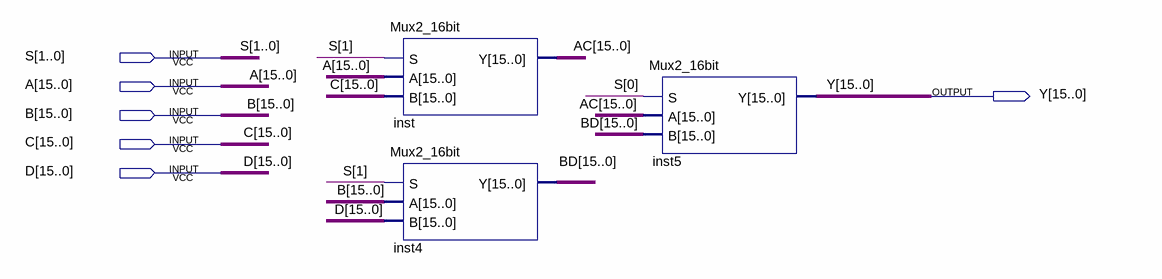
[diagram p0: schematic sheet]
// Quartus schematic Mux4_16bit.bdf as structural Verilog: 3 symbols, 6 pins
module Mux4_16bit (
  input  [1:0] S,
  input  [15:0] A,
  input  [15:0] B,
  input  [15:0] C,
  input  [15:0] D,
  output [15:0] Y
);

  wire [15:0] AC, BD;

  Mux2_16bit inst (.S(S[1]), .A(A), .B(C), .Y(AC));
  Mux2_16bit inst4 (.S(S[1]), .A(B), .B(D), .Y(BD));
  Mux2_16bit inst5 (.S(S[0]), .A(AC), .B(BD), .Y(Y));
endmodule
